# Altium schematic sheet SoftCore_SA_P2.SchDoc: =ProjectTitle
size B; Engineer: Hab S Collector; Address1: 3621 Gin Way; Address2: Snellville GA, 30039; SheetNumber: 2; SheetTotal: 7
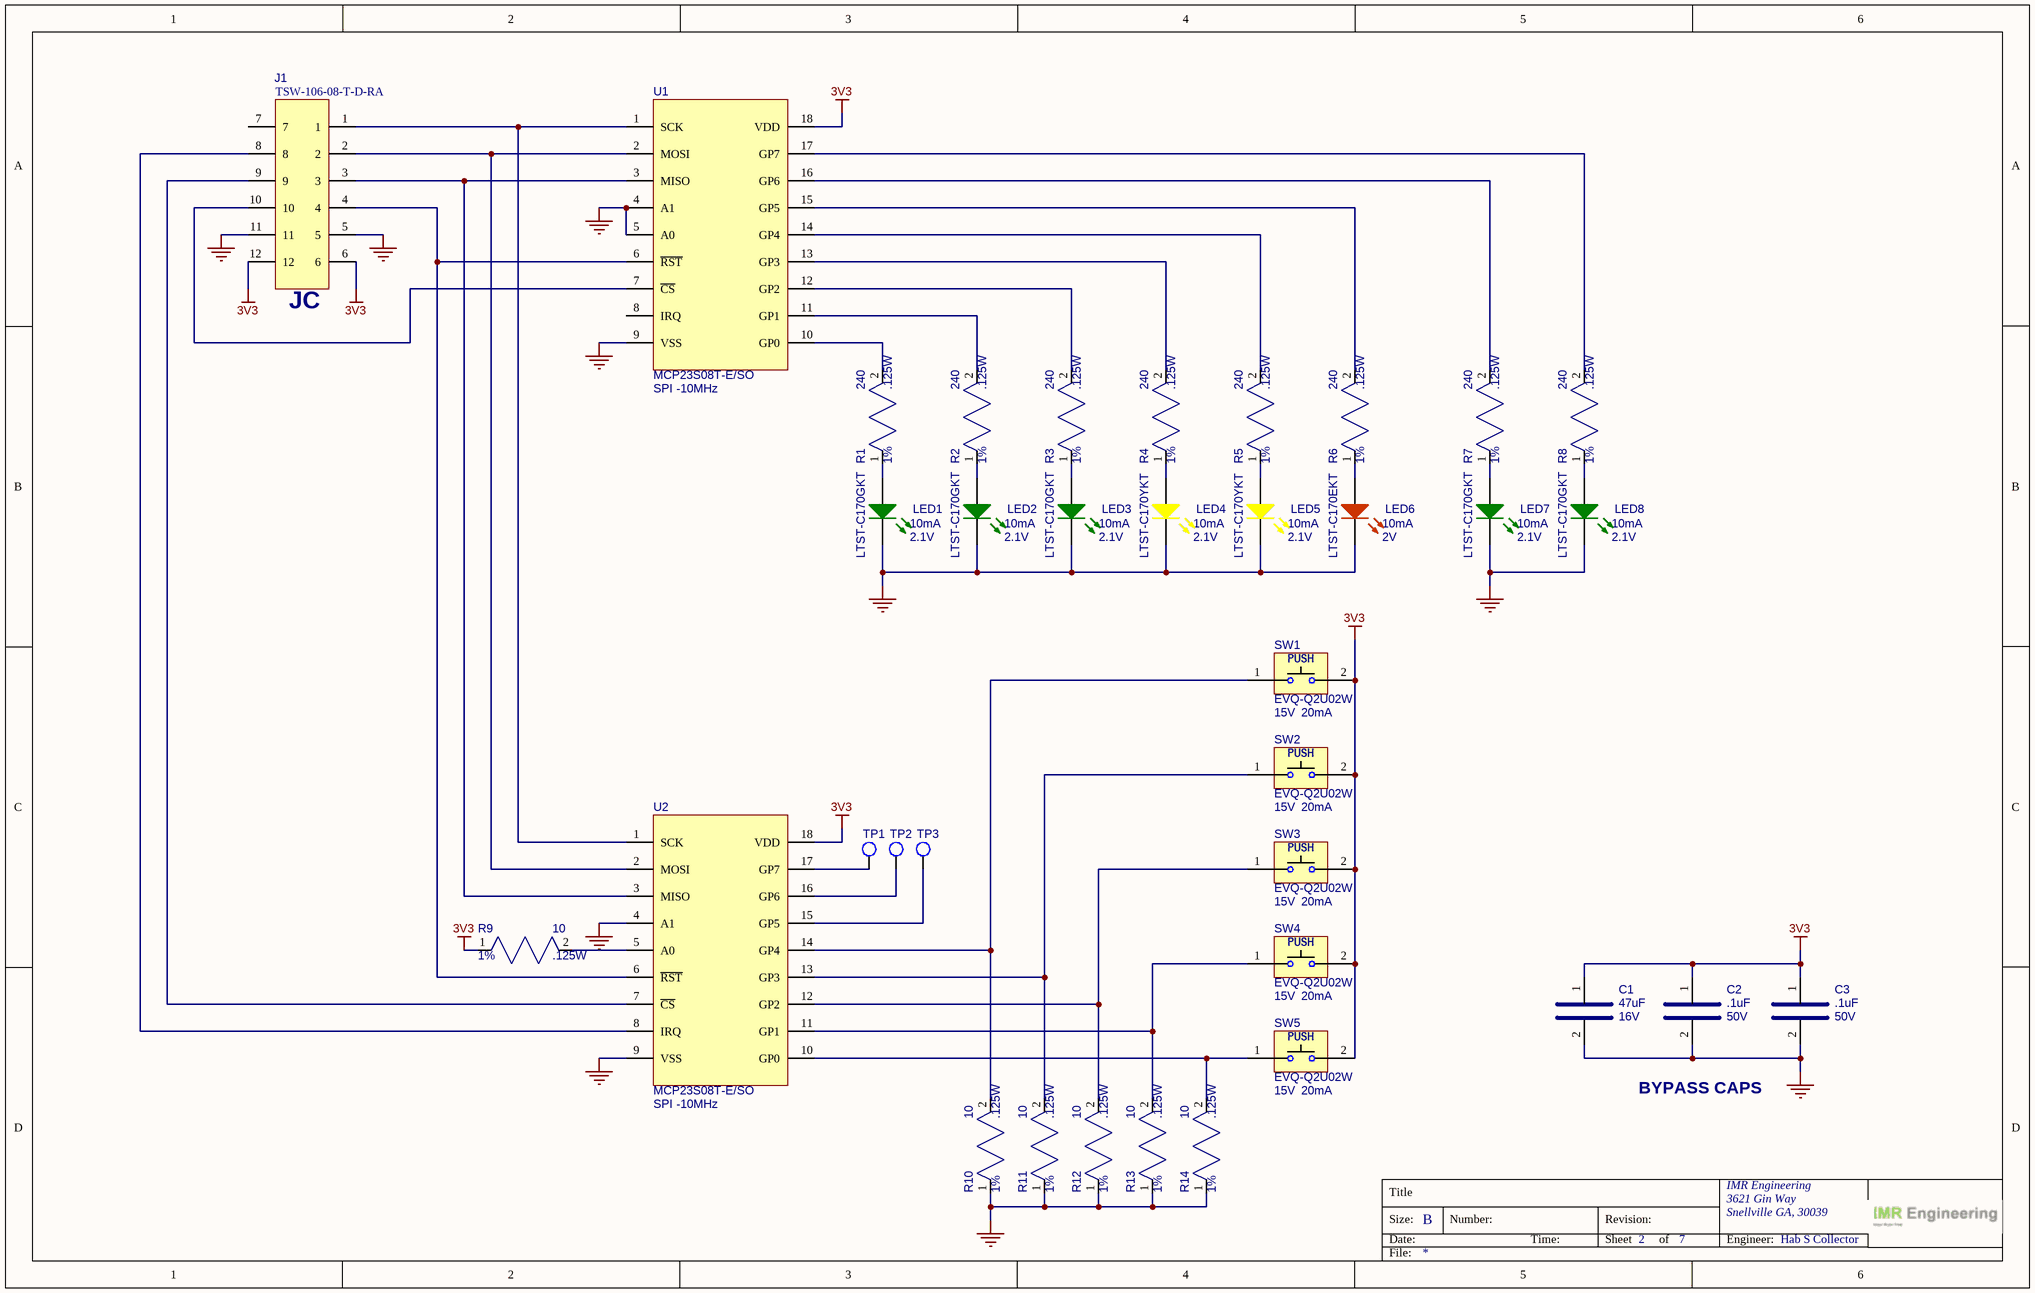
[diagram p0: SoftCore_SA_P2.SchDoc]

## Parts
C1  value 47uF  Voltage: 16V  [CAP_1210]  (hidden comment: GRM32ER60J476ME20L)
C2  value .1uF  Voltage: 50V  [CAP_0805]  (hidden comment: KGM21NR71H104KT)
C3  value .1uF  Voltage: 50V  [CAP_0805]  (hidden comment: KGM21NR71H104KT)
J1  TSW-106-08-T-D-RA  [SAMTEC_TSW-106-08-T-D-RA]
LED1  value 2.1V  Current: 10mA  [LED_0805]  (hidden comment: LTST-C170GKT)
LED2  value 2.1V  Current: 10mA  [LED_0805]  (hidden comment: LTST-C170GKT)
LED3  value 2.1V  Current: 10mA  [LED_0805]  (hidden comment: LTST-C170GKT)
LED4  value 2.1V  Current: 10mA  [LED_0805]  (hidden comment: LTST-C170YKT)
LED5  value 2.1V  Current: 10mA  [LED_0805]  (hidden comment: LTST-C170YKT)
LED6  value 2V  Current: 10mA  [LED_0805]  (hidden comment: LTST-C170EKT)
LED7  value 2.1V  Current: 10mA  [LED_0805]  (hidden comment: LTST-C170GKT)
LED8  value 2.1V  Current: 10mA  [LED_0805]  (hidden comment: LTST-C170GKT)
R1  value 240  Power: .125W  Tolerance: 1%  [RES_0805]  (hidden comment: RC0805FR-13240RL)
R2  value 240  Power: .125W  Tolerance: 1%  [RES_0805]  (hidden comment: RC0805FR-13240RL)
R3  value 240  Power: .125W  Tolerance: 1%  [RES_0805]  (hidden comment: RC0805FR-13240RL)
R4  value 240  Power: .125W  Tolerance: 1%  [RES_0805]  (hidden comment: RC0805FR-13240RL)
R5  value 240  Power: .125W  Tolerance: 1%  [RES_0805]  (hidden comment: RC0805FR-13240RL)
R6  value 240  Power: .125W  Tolerance: 1%  [RES_0805]  (hidden comment: RC0805FR-13240RL)
R7  value 240  Power: .125W  Tolerance: 1%  [RES_0805]  (hidden comment: RC0805FR-13240RL)
R8  value 240  Power: .125W  Tolerance: 1%  [RES_0805]  (hidden comment: RC0805FR-13240RL)
R9  value 10  Power: .125W  Tolerance: 1%  [RES_0805]  (hidden comment: RC0805FR-1310RL)
R10  value 10  Power: .125W  Tolerance: 1%  [RES_0805]  (hidden comment: RC0805FR-1310RL)
R11  value 10  Power: .125W  Tolerance: 1%  [RES_0805]  (hidden comment: RC0805FR-1310RL)
R12  value 10  Power: .125W  Tolerance: 1%  [RES_0805]  (hidden comment: RC0805FR-1310RL)
R13  value 10  Power: .125W  Tolerance: 1%  [RES_0805]  (hidden comment: RC0805FR-1310RL)
R14  value 10  Power: .125W  Tolerance: 1%  [RES_0805]  (hidden comment: RC0805FR-1310RL)
SW1  value 15V  Current: 20mA  [PANASONIC_EVQ-Q2U02W]  (hidden comment: EVQ-Q2U02W)
SW2  value 15V  Current: 20mA  [PANASONIC_EVQ-Q2U02W]  (hidden comment: EVQ-Q2U02W)
SW3  value 15V  Current: 20mA  [PANASONIC_EVQ-Q2U02W]  (hidden comment: EVQ-Q2U02W)
SW4  value 15V  Current: 20mA  [PANASONIC_EVQ-Q2U02W]  (hidden comment: EVQ-Q2U02W)
SW5  value 15V  Current: 20mA  [PANASONIC_EVQ-Q2U02W]  (hidden comment: EVQ-Q2U02W)
TP1  (no value)  [TEST_POINT_20MIL_TH]  (no BOM)
TP2  (no value)  [TEST_POINT_20MIL_TH]  (no BOM)
TP3  (no value)  [TEST_POINT_20MIL_TH]  (no BOM)
U1  value SPI -10MHz  [SOIC-18_300]  (hidden comment: MCP23S08T-E/SO)
U2  value SPI -10MHz  [SOIC-18_300]  (hidden comment: MCP23S08T-E/SO)

## Nets
3V3: C1.1 C2.1 C3.1 J1.6 J1.12 R9.1 SW1.2(B') SW2.2(B') SW3.2(B') SW4.2(B') SW5.2(B') U1.18(VDD) U2.18(VDD)
GND: C1.2 C2.2 C3.2 J1.5 J1.11 LED1.K LED2.K LED3.K LED4.K LED5.K LED6.K LED7.K LED8.K R10.1 R11.1 R12.1 R13.1 R14.1 U1.4(A1) U1.5(A0) U1.9(VSS) U2.4(A1) U2.9(VSS)
NetJ1_1: J1.1 U1.1(SCK) U2.1(SCK)
NetJ1_2: J1.2 U1.2(MOSI) U2.2(MOSI)
NetJ1_3: J1.3 U1.3(MISO) U2.3(MISO)
NetJ1_4: J1.4 U1.6(~{RST}) U2.6(~{RST})
NetJ1_8: J1.8 U2.8(IRQ)
NetJ1_9: J1.9 U2.7(~{CS})
NetJ1_10: J1.10 U1.7(~{CS})
NetLED1_A: LED1.A R1.1
NetLED2_A: LED2.A R2.1
NetLED3_A: LED3.A R3.1
NetLED4_A: LED4.A R4.1
NetLED5_A: LED5.A R5.1
NetLED6_A: LED6.A R6.1
NetLED7_A: LED7.A R7.1
NetLED8_A: LED8.A R8.1
NetR1_2: R1.2 U1.10(GP0)
NetR2_2: R2.2 U1.11(GP1)
NetR3_2: R3.2 U1.12(GP2)
NetR4_2: R4.2 U1.13(GP3)
NetR5_2: R5.2 U1.14(GP4)
NetR6_2: R6.2 U1.15(GP5)
NetR7_2: R7.2 U1.16(GP6)
NetR8_2: R8.2 U1.17(GP7)
NetR9_2: R9.2 U2.5(A0)
NetR10_2: R10.2 SW1.1(B) U2.14(GP4)
NetR11_2: R11.2 SW2.1(B) U2.13(GP3)
NetR12_2: R12.2 SW3.1(B) U2.12(GP2)
NetR13_2: R13.2 SW4.1(B) U2.11(GP1)
NetR14_2: R14.2 SW5.1(B) U2.10(GP0)
NetTP1_1: TP1.1 U2.17(GP7)
NetTP2_1: TP2.1 U2.16(GP6)
NetTP3_1: TP3.1 U2.15(GP5)

Not connected (* = marked no-connect by the designer): J1 7; U1 8(IRQ)

## Notes on the sheet
- (near J1) JC
- BYPASS CAPS
- Title
- Size:
- Date:
- B
- Number:
- Time:
- Revision:
- Sheet
- of
- IMR Engineering
- Engineer:
- File:
- (in symbol SWITCH_EVQ-Q2U02W) PUSH

## Library data of the parts
C1 = CAP_SMD_47UF_16V_1210: CAP CER 47UF 50V X5R 1210; MFG: Murata Electronics; Case/Package: 1210; MFG_PN: GRM32ER60J476ME20L; Supplier 1: DigiKey; Supplier Part Number 1: 490-1887-1-ND; Unit Price: .28
C2 C3 = CAP_SMD_0.1UF_50V_0805: CAP CER 0.1UF 50V X7R 0805; MFG: KYOCERA AVX; Case/Package: 0805; MFG_PN: KGM21NR71H104KT; Supplier 1: DigiKey; Supplier Part Number 1: 478-KGM21NR71H104KTCT-ND; Unit Price: .1
J1 = CONN_HEADER_12P_100MIL_RA: CONN HEADER R/A 12POS 2.54MM; MFG: Samtec Inc.; Case/Package: 2P_2.54MM; Supplier 1: Digi-Key; Supplier Part Number 1: SAM1049-06-ND; Unit Price: .93; MFG_PN: TSW-106-08-T-D-RA
LED1-LED3 LED7 LED8 = LED_GREEN_LTST-C170GKT: LED GREEN CLEAR SMD; MFG: Lite-On; Case/Package: 0805; Supplier 1: DigiKey; Supplier Part Number 1: 160-1179-1-ND; Unit Price: .10; MFG_PN: LTST-C170GKT
LED4 LED5 = LED_YELLOW_LTST-C170YKT: LED YELLOW CLEAR SMD; MFG: Lite-On; Case/Package: 0805; Supplier 1: DigiKey; Supplier Part Number 1: 160-1175-1-ND; Unit Price: .15; MFG_PN: LTST-C170YKT
LED6 = LED_RED_LTST-C170EKT: LED RED CLEAR SMD; MFG: Lite-On; Case/Package: 0805; Supplier 1: DigiKey; Supplier Part Number 1: 160-1178-1-ND; Unit Price: .18; MFG_PN: LTST-C170EKT
R1-R8 = RES_SMD_240_0805_1/8W_1%: RES SMD 240 OHM 1% 1/8W 0805; MFG: Yageo; Case/Package: 0805; MFG_PN: RC0805FR-13240RL; Supplier 1: DigiKey; Supplier Part Number 1: 13-RC0805FR-13240RLCT-ND; Unit Price: .1
R9-R14 = RES_SMD_10_0805_1/8W_1%: RES SMD 10 OHM 1% 1/8W 0805; MFG: Yageo; Case/Package: 0805; MFG_PN: RC0805FR-1310RL; Supplier 1: DigiKey; Supplier Part Number 1: 13-RC0805FR-1310RLCT-ND; Unit Price: .1
SW1-SW5 = SWITCH_EVQ-Q2U02W: SWITCH TACTILE SPST-NO 0.02A 15V; MFG: American Zettler; Case/Package: EVQQ2; Supplier 1: DigiKey; Supplier Part Number 1: P12954SCT-ND; Unit Price: .25; MFG_PN: EVQ-Q2U02W
TP1-TP3 = CONN_TEST_POINT_TH_PAD_20MIL: TEST POINT TH 20MIL HOLE
U1 U2 = IC_MCP23S08T-E/SO: IC IO XPNDR 10MHZ SPI 18SOIC; MFG: Microchip; Case/Package: SOIC-18-300; Supplier 1: DigiKey; Supplier Part Number 1: MCP23S08T-E/SOCT-ND; Unit Price: 1.54; MFG_PN: MCP23S08T-E/SO